# Altium schematic sheet DM3390_CAM_FFC_ESD_AUX.SchDoc: =project_title
size Tabloid; PageSetup: Record=PageOptions|CenterHorizontal=True|CenterVertical=True|PrintScale=0.73|XCorrection=1.00|YCorrection=1.00|PrintKind=0|BorderSize=5000000|LeftOffset=0|BottomOffset=0|Orientation=2|PaperLength=1000|PaperWidth=1000|Scale=100|PaperSource=7|PrintQuality=-4|MediaType=1|DitherType=10|PaperKind=A4|PrintScaleMode=1; CompanyName: Luxonis Holding; Organization: Luxonis Holding; Address1: 1925 Harmony Park Drive; Address2: Westminster, CO; Address3: 80234; Address4: United States; SheetNumber: 5; SheetTotal: 12
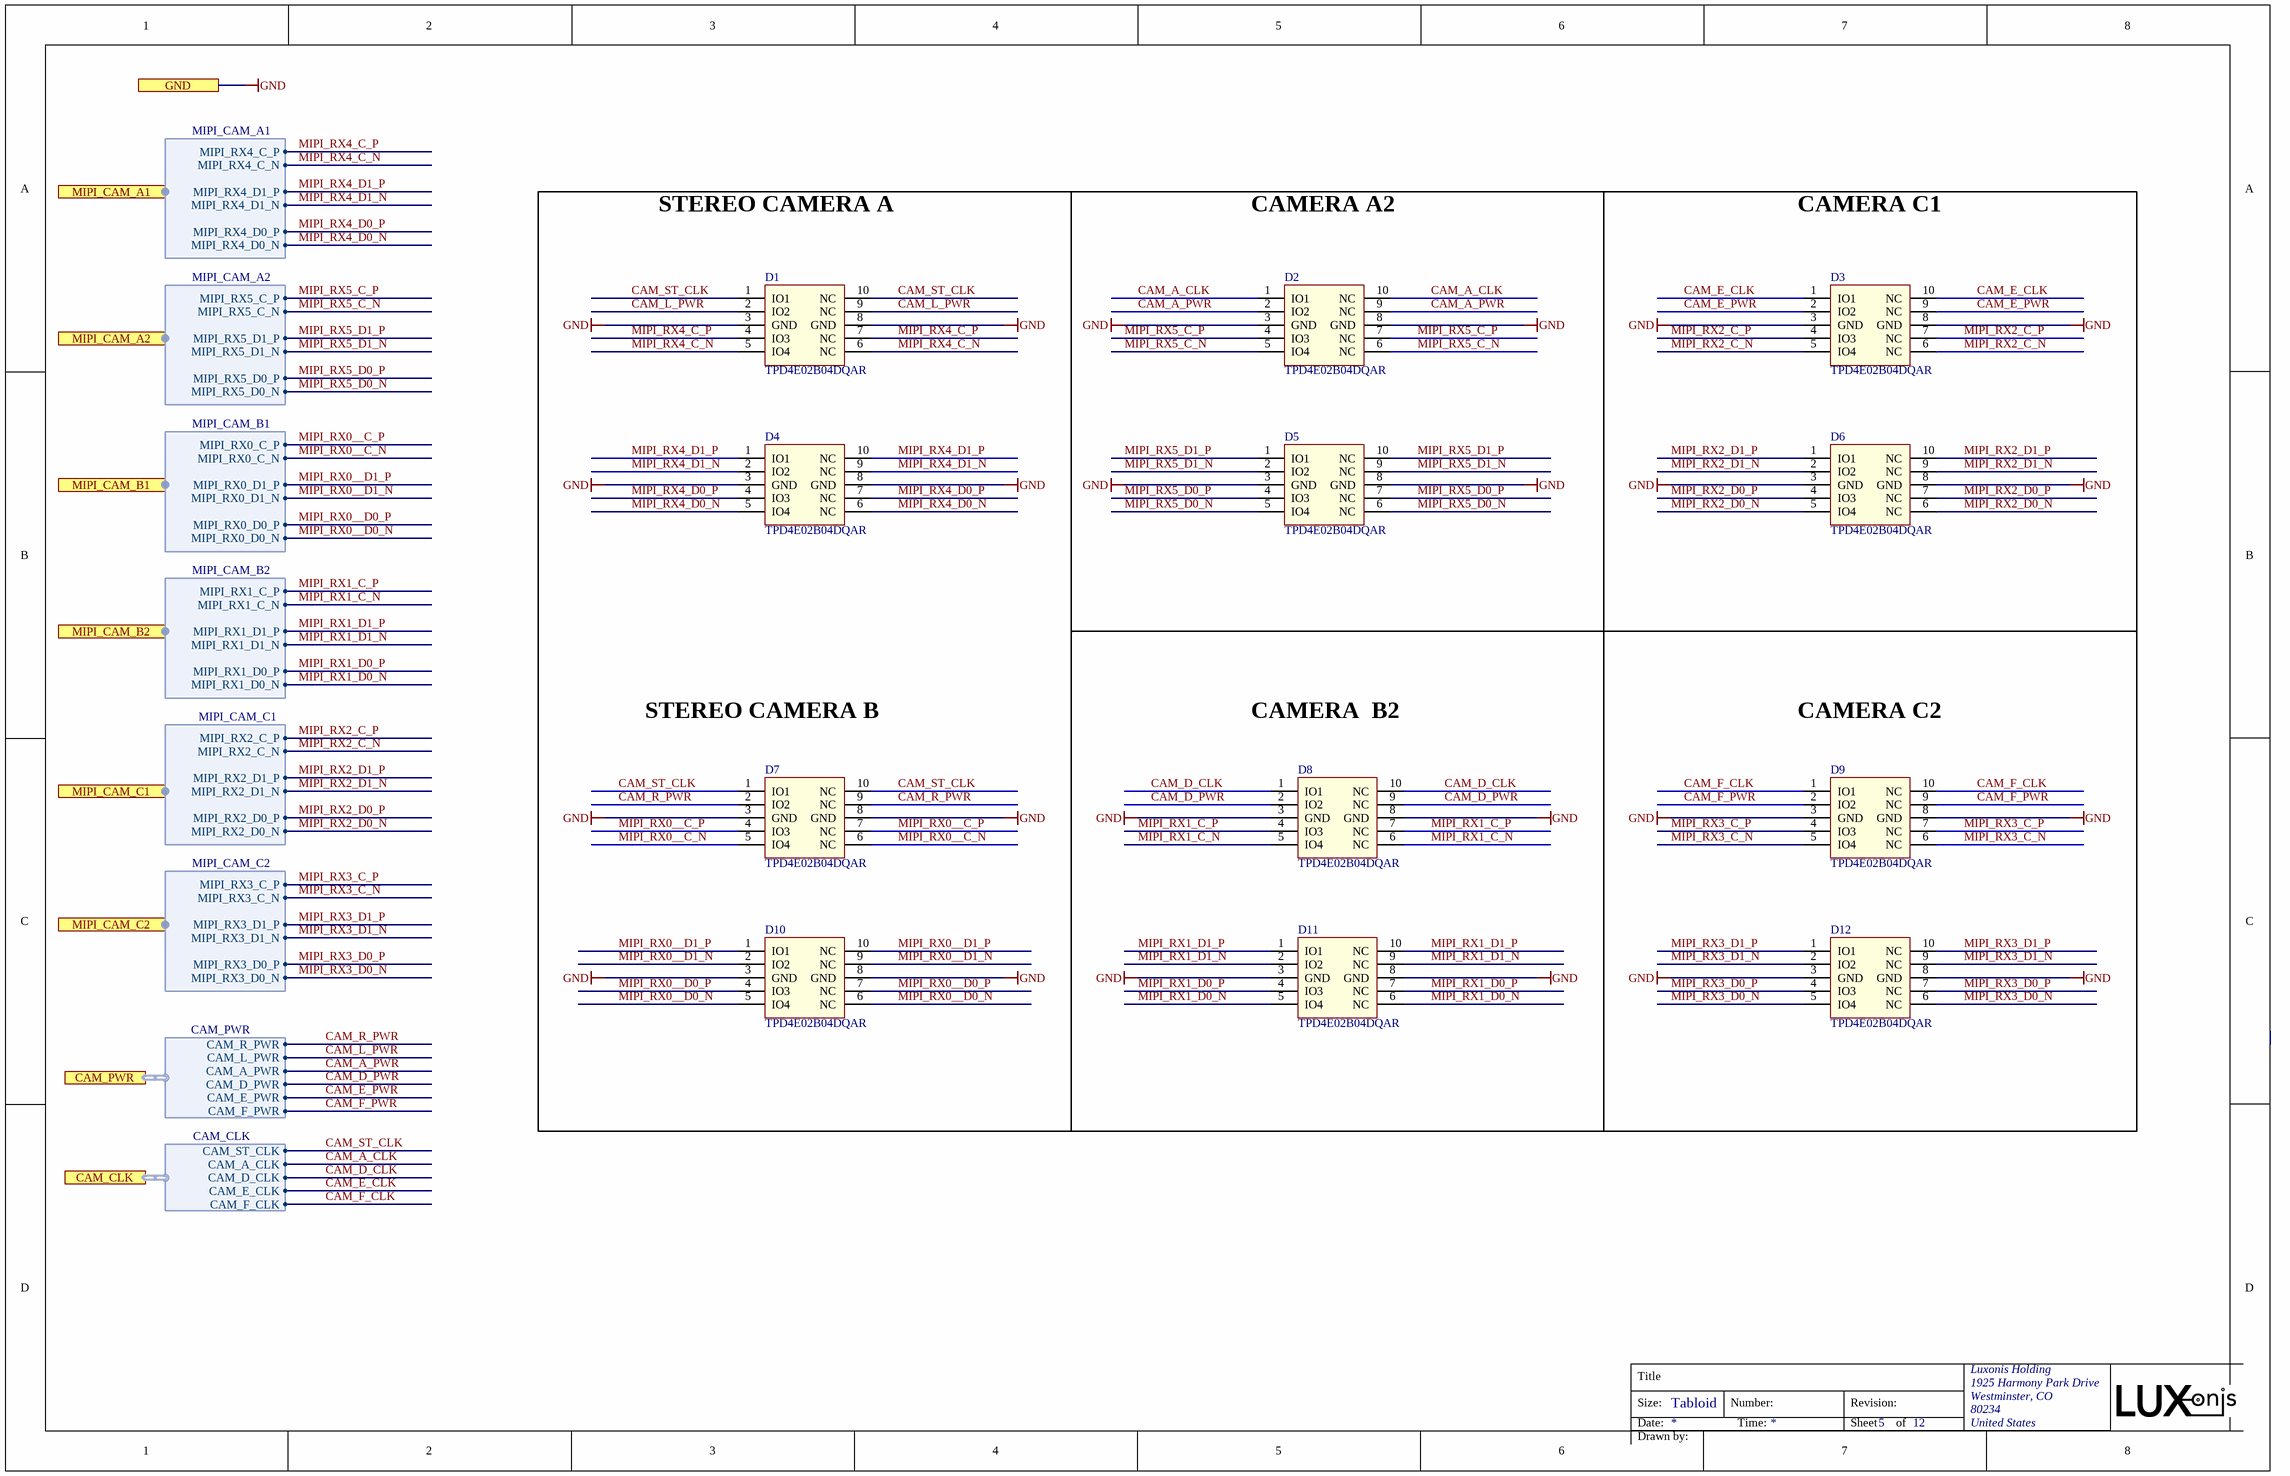
[diagram p0: DM3390_CAM_FFC_ESD_AUX.SchDoc]

## Parts
D1  TPD4E02B04DQAR  [TPD4E02B04DQAR]
D2  TPD4E02B04DQAR  [TPD4E02B04DQAR]
D3  TPD4E02B04DQAR  [TPD4E02B04DQAR]
D4  TPD4E02B04DQAR  [TPD4E02B04DQAR]
D5  TPD4E02B04DQAR  [TPD4E02B04DQAR]
D6  TPD4E02B04DQAR  [TPD4E02B04DQAR]
D7  TPD4E02B04DQAR  [TPD4E02B04DQAR]
D8  TPD4E02B04DQAR  [TPD4E02B04DQAR]
D9  TPD4E02B04DQAR  [TPD4E02B04DQAR]
D10  TPD4E02B04DQAR  [TPD4E02B04DQAR]
D11  TPD4E02B04DQAR  [TPD4E02B04DQAR]
D12  TPD4E02B04DQAR  [TPD4E02B04DQAR]

## Blocks framed on the sheet
CAMERA A2: D2 D5
CAMERA C1: D3 D6
CAMERA  B2: D8 D11
CAMERA C2: D9 D12

## Ports
CAM_CLK (harness CAM_CLK), CAM_PWR (harness CAM_PWR), GND, MIPI_CAM_A1 (harness MIPI_CAM_A1), MIPI_CAM_A2 (harness MIPI_CAM_A2), MIPI_CAM_B1 (harness MIPI_CAM_B1), MIPI_CAM_B2 (harness MIPI_CAM_B2), MIPI_CAM_C1 (harness MIPI_CAM_C1), MIPI_CAM_C2 (harness MIPI_CAM_C2)

## Harnesses
MIPI_CAM_C1: MIPI_RX2_D0_P, MIPI_RX2_D0_N, MIPI_RX2_D1_P, MIPI_RX2_D1_N, MIPI_RX2_C_P, MIPI_RX2_C_N
MIPI_CAM_C2: MIPI_RX3_C_P, MIPI_RX3_C_N, MIPI_RX3_D0_N, MIPI_RX3_D0_P, MIPI_RX3_D1_P, MIPI_RX3_D1_N
MIPI_CAM_B2: MIPI_RX1_D1_P, MIPI_RX1_D1_N, MIPI_RX1_C_P, MIPI_RX1_C_N, MIPI_RX1_D0_P, MIPI_RX1_D0_N
MIPI_CAM_B1: MIPI_RX0_D1_P, MIPI_RX0_D1_N, MIPI_RX0_C_P, MIPI_RX0_C_N, MIPI_RX0_D0_P, MIPI_RX0_D0_N
MIPI_CAM_A1: MIPI_RX4_D1_P, MIPI_RX4_D1_N, MIPI_RX4_C_P, MIPI_RX4_C_N, MIPI_RX4_D0_P, MIPI_RX4_D0_N
MIPI_CAM_A2: MIPI_RX5_D1_P, MIPI_RX5_D1_N, MIPI_RX5_C_P, MIPI_RX5_C_N, MIPI_RX5_D0_P, MIPI_RX5_D0_N
CAM_PWR: CAM_R_PWR, CAM_L_PWR, CAM_A_PWR, CAM_D_PWR, CAM_E_PWR, CAM_F_PWR
CAM_CLK: CAM_ST_CLK, CAM_A_CLK, CAM_D_CLK, CAM_E_CLK, CAM_F_CLK

## Nets
GND: D1.3(GND) D1.8(GND) D2.3(GND) D2.8(GND) D3.3(GND) D3.8(GND) D4.3(GND) D4.8(GND) D5.3(GND) D5.8(GND) D6.3(GND) D6.8(GND) D7.3(GND) D7.8(GND) D8.3(GND) D8.8(GND) D9.3(GND) D9.8(GND) D10.3(GND) D10.8(GND) D11.3(GND) D11.8(GND) D12.3(GND) D12.8(GND) ; port GND
CAM_A_CLK: D2.1(IO1) D2.10(NC) ; port CAM_CLK.CAM_A_CLK
CAM_A_PWR: D2.2(IO2) D2.9(NC) ; port CAM_PWR.CAM_A_PWR
CAM_D_CLK: D8.1(IO1) D8.10(NC) ; port CAM_CLK.CAM_D_CLK
CAM_D_PWR: D8.2(IO2) D8.9(NC) ; port CAM_PWR.CAM_D_PWR
CAM_E_CLK: D3.1(IO1) D3.10(NC) ; port CAM_CLK.CAM_E_CLK
CAM_E_PWR: D3.2(IO2) D3.9(NC) ; port CAM_PWR.CAM_E_PWR
CAM_F_CLK: D9.1(IO1) D9.10(NC) ; port CAM_CLK.CAM_F_CLK
CAM_F_PWR: D9.2(IO2) D9.9(NC) ; port CAM_PWR.CAM_F_PWR
CAM_L_PWR: D1.2(IO2) D1.9(NC) ; port CAM_PWR.CAM_L_PWR
CAM_R_PWR: D7.2(IO2) D7.9(NC) ; port CAM_PWR.CAM_R_PWR
CAM_ST_CLK: D1.1(IO1) D1.10(NC) D7.1(IO1) D7.10(NC) ; port CAM_CLK.CAM_ST_CLK
MIPI_RX0__C_N: D7.5(IO4) D7.6(NC) ; port MIPI_CAM_B1.MIPI_RX0_C_N
MIPI_RX0__C_P: D7.4(IO3) D7.7(NC) ; port MIPI_CAM_B1.MIPI_RX0_C_P
MIPI_RX0__D0_N: D10.5(IO4) D10.6(NC) ; port MIPI_CAM_B1.MIPI_RX0_D0_N
MIPI_RX0__D0_P: D10.4(IO3) D10.7(NC) ; port MIPI_CAM_B1.MIPI_RX0_D0_P
MIPI_RX0__D1_N: D10.2(IO2) D10.9(NC) ; port MIPI_CAM_B1.MIPI_RX0_D1_N
MIPI_RX0__D1_P: D10.1(IO1) D10.10(NC) ; port MIPI_CAM_B1.MIPI_RX0_D1_P
MIPI_RX1_C_N: D8.5(IO4) D8.6(NC) ; port MIPI_CAM_B2.MIPI_RX1_C_N
MIPI_RX1_C_P: D8.4(IO3) D8.7(NC) ; port MIPI_CAM_B2.MIPI_RX1_C_P
MIPI_RX1_D0_N: D11.5(IO4) D11.6(NC) ; port MIPI_CAM_B2.MIPI_RX1_D0_N
MIPI_RX1_D0_P: D11.4(IO3) D11.7(NC) ; port MIPI_CAM_B2.MIPI_RX1_D0_P
MIPI_RX1_D1_N: D11.2(IO2) D11.9(NC) ; port MIPI_CAM_B2.MIPI_RX1_D1_N
MIPI_RX1_D1_P: D11.1(IO1) D11.10(NC) ; port MIPI_CAM_B2.MIPI_RX1_D1_P
MIPI_RX2_C_N: D3.5(IO4) D3.6(NC) ; port MIPI_CAM_C1.MIPI_RX2_C_N
MIPI_RX2_C_P: D3.4(IO3) D3.7(NC) ; port MIPI_CAM_C1.MIPI_RX2_C_P
MIPI_RX2_D0_N: D6.5(IO4) D6.6(NC) ; port MIPI_CAM_C1.MIPI_RX2_D0_N
MIPI_RX2_D0_P: D6.4(IO3) D6.7(NC) ; port MIPI_CAM_C1.MIPI_RX2_D0_P
MIPI_RX2_D1_N: D6.2(IO2) D6.9(NC) ; port MIPI_CAM_C1.MIPI_RX2_D1_N
MIPI_RX2_D1_P: D6.1(IO1) D6.10(NC) ; port MIPI_CAM_C1.MIPI_RX2_D1_P
MIPI_RX3_C_N: D9.5(IO4) D9.6(NC) ; port MIPI_CAM_C2.MIPI_RX3_C_N
MIPI_RX3_C_P: D9.4(IO3) D9.7(NC) ; port MIPI_CAM_C2.MIPI_RX3_C_P
MIPI_RX3_D0_N: D12.5(IO4) D12.6(NC) ; port MIPI_CAM_C2.MIPI_RX3_D0_N
MIPI_RX3_D0_P: D12.4(IO3) D12.7(NC) ; port MIPI_CAM_C2.MIPI_RX3_D0_P
MIPI_RX3_D1_N: D12.2(IO2) D12.9(NC) ; port MIPI_CAM_C2.MIPI_RX3_D1_N
MIPI_RX3_D1_P: D12.1(IO1) D12.10(NC) ; port MIPI_CAM_C2.MIPI_RX3_D1_P
MIPI_RX4_C_N: D1.5(IO4) D1.6(NC) ; port MIPI_CAM_A1.MIPI_RX4_C_N
MIPI_RX4_C_P: D1.4(IO3) D1.7(NC) ; port MIPI_CAM_A1.MIPI_RX4_C_P
MIPI_RX4_D0_N: D4.5(IO4) D4.6(NC) ; port MIPI_CAM_A1.MIPI_RX4_D0_N
MIPI_RX4_D0_P: D4.4(IO3) D4.7(NC) ; port MIPI_CAM_A1.MIPI_RX4_D0_P
MIPI_RX4_D1_N: D4.2(IO2) D4.9(NC) ; port MIPI_CAM_A1.MIPI_RX4_D1_N
MIPI_RX4_D1_P: D4.1(IO1) D4.10(NC) ; port MIPI_CAM_A1.MIPI_RX4_D1_P
MIPI_RX5_C_N: D2.5(IO4) D2.6(NC) ; port MIPI_CAM_A2.MIPI_RX5_C_N
MIPI_RX5_C_P: D2.4(IO3) D2.7(NC) ; port MIPI_CAM_A2.MIPI_RX5_C_P
MIPI_RX5_D0_N: D5.5(IO4) D5.6(NC) ; port MIPI_CAM_A2.MIPI_RX5_D0_N
MIPI_RX5_D0_P: D5.4(IO3) D5.7(NC) ; port MIPI_CAM_A2.MIPI_RX5_D0_P
MIPI_RX5_D1_N: D5.2(IO2) D5.9(NC) ; port MIPI_CAM_A2.MIPI_RX5_D1_N
MIPI_RX5_D1_P: D5.1(IO1) D5.10(NC) ; port MIPI_CAM_A2.MIPI_RX5_D1_P

## Notes on the sheet
- STEREO CAMERA A
- STEREO CAMERA B
- Title
- Size:
- Date:
- Tabloid
- Number:
- Time:
- Revision:
- Sheet
- of
- Drawn by:

## Library data of the parts
D1-D12 = TPD4E02B04DQAR: TVS DIODE 3.6V 8.8V 10USON 8.8V (Typ) Clamp 5A (8/20µs) Ipp Tvs Diode Surface Mount 10-USON (2.5x1); Manufacturer 1: Texas Instruments; Number of Bidirectional Channels: 4; Min Breakdown Voltage: 5.5V; Peak Pulse Power: 17W; Power Line Protection: No; Interface: USB,HDMI; Supplier 1: Digi-Key; Manufacturer Part Number 1: TPD4E02B04DQAR; Stock 1: 25615; Pricing 1: 1=0.69000, 10=0.60800, 100=0.46650, 500=0.36874, 1000=0.29499 (USD); RoHS: Yes; Mount: Surface Mount; Number of Pins: 10; Min Operating Temperature: -40°C; Max Operating Temperature: 125°C; Packaging: Cut Tape; Reverse Standoff Voltage: 3.6V; Clamping Voltage: 8.8V; Operating Supply Voltage: 3.6V; Peak Pulse Current: 5A; Number of Channels: 4; Composition: Zener; REACH SVHC: No SVHC; Lead Free: Lead Free; ComponentLink1URL: http://www.ti.com/general/docs/lit/getliterature.tsp?genericPartNumber=TPD4E02B04&amp;&amp;fileType=pdf&src-supplier=Element14; ComponentLink1Description: http://www.ti.com/general/docs/lit/getliterature.tsp?genericPartNumber=TPD4E02B04&amp;&amp;fileType=pdf&src-supplier=Element14; ComponentLink2URL: http://www.ti.com/lit/ds/symlink/tpd4e02b04.pdf?src-supplier=Farnell; ComponentLink2Description: http://www.ti.com/lit/ds/symlink/tpd4e02b04.pdf?src-supplier=Farnell; ComponentLink3URL: http://www.ti.com/lit/ds/symlink/tpd4e02b04.pdf?src-supplier=Newark; ComponentLink3Description: http://www.ti.com/lit/ds/symlink/tpd4e02b04.pdf?src-supplier=Newark; ComponentLink4URL: http://www.ti.com/lit/ds/symlink/tpd4e02b04.pdf?src-supplier=Digi-Key; ComponentLink4Description: http://www.ti.com/lit/ds/symlink/tpd4e02b04.pdf?src-supplier=Digi-Key; Supplier Part Number 1: 296-43875-1-ND